# Altium schematic sheet Buck_Converter.SchDoc
size A3; DocumentNumber: 10; SheetNumber: 10; SheetTotal: 11
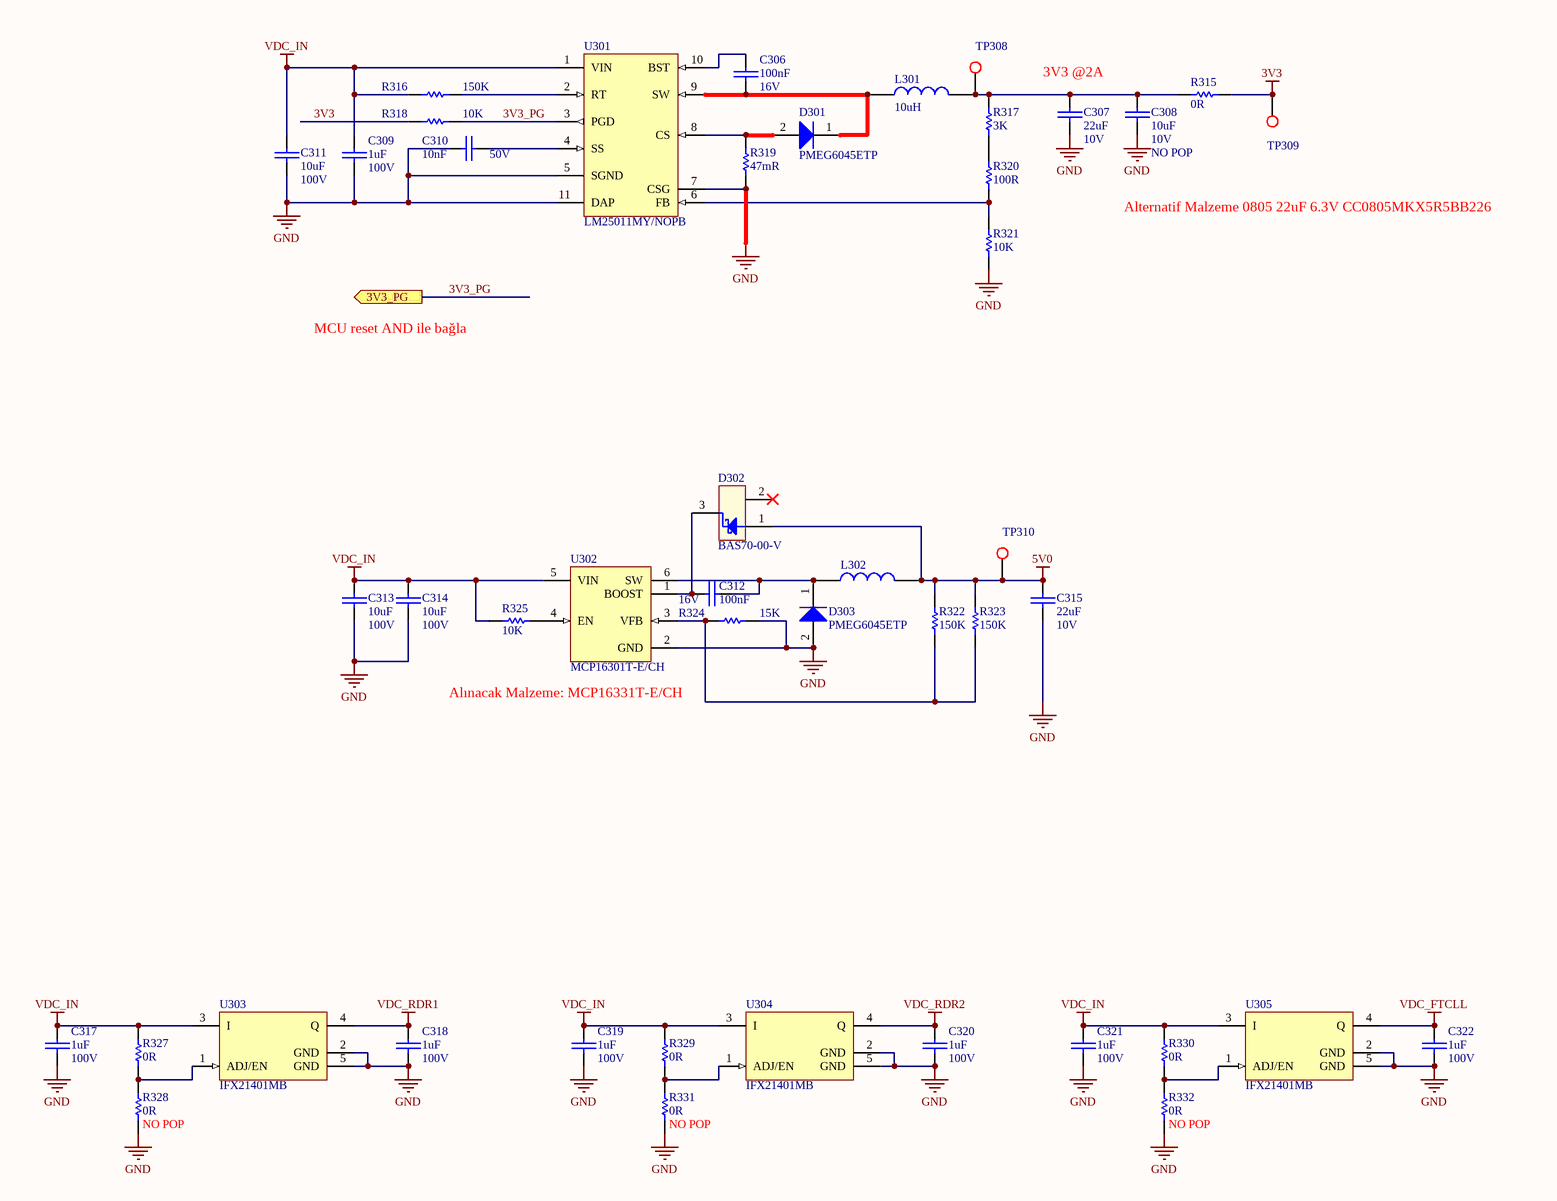
[diagram p0: Buck_Converter.SchDoc]

## Parts
C306  Operating Voltage: 16V  [CAPC1005X06N]  (hidden comment: 100nF)
C307  Operating Voltage: 10V  [CAPC3225X27N]  (hidden comment: 22uF)
C308  Operating Voltage: 10V  Assembly: NO POP  [CAPC2012X09N]  (hidden comment: 10uF)
C309  Operating Voltage: 100V  [CAPC3216X09N]  (hidden comment: 1uF)
C310  Operating Voltage: 50V  [CAPC1005X06N]  (hidden comment: 10nF)
C311  Operating Voltage: 100V  [CAPC5750X25N]  (hidden comment: 10uF)
C312  Operating Voltage: 16V  [CAPC1005X06N]  (hidden comment: 100nF)
C313  Operating Voltage: 100V  [CAPC5750X25N]  (hidden comment: 10uF)
C314  Operating Voltage: 100V  [CAPC5750X25N]  (hidden comment: 10uF)
C315  Operating Voltage: 10V  [CAPC3225X27N]  (hidden comment: 22uF)
C317  Operating Voltage: 100V  [CAPC3216X09N]  (hidden comment: 1uF)
C318  Operating Voltage: 100V  [CAPC3216X09N]  (hidden comment: 1uF)
C319  Operating Voltage: 100V  [CAPC3216X09N]  (hidden comment: 1uF)
C320  Operating Voltage: 100V  [CAPC3216X09N]  (hidden comment: 1uF)
C321  Operating Voltage: 100V  [CAPC3216X09N]  (hidden comment: 1uF)
C322  Operating Voltage: 100V  [CAPC3216X09N]  (hidden comment: 1uF)
D301  PMEG6045ETP  [DIOM3825X11N]
D302  BAS70-00-V  [SOT90P247X115-3N]
D303  PMEG6045ETP  [DIOM3825X11N]
L301  10uH  [INDM125125X65N]
L302  (no value)  [INDM125125X65N]
R315  0R  [RESC2012X07N]
R316  150K  [RESC1005X04N]
R317  3K  [RESC1005X04N]
R318  10K  [RESC1005X04N]
R319  47mR  [RESC3216X08N]
R320  100R  [RESC1005X04N]
R321  10K  [RESC1005X04N]
R322  150K  [RESC1005X04N]
R323  150K  [RESC1005X04N]
R324  15K  [RESC1005X04N]
R325  10K  [RESC1005X04N]
R327  0R  [RESC1005X04N]
R328  Assembly: NO POP  [RESC1005X04N]  (hidden comment: 0R)
R329  0R  [RESC1005X04N]
R330  0R  [RESC1005X04N]
R331  Assembly: NO POP  [RESC1005X04N]  (hidden comment: 0R)
R332  Assembly: NO POP  [RESC1005X04N]  (hidden comment: 0R)
TP308  AEMT-C00S-1000-0000  [TP100]  (value not drawn)
TP309  AEMT-C00S-1000-0000  [TP100]  (value not drawn)
TP310  AEMT-C00S-1000-0000  [TP100]  (value not drawn)
U301  LM25011MY/NOPB  [MUC10A_N]
U302  MCP16301T-E/CH  [MCHP-SOT-23-CH6_N]
U303  IFX21401MB  [INF-PG-SCT595_V]
U304  IFX21401MB  [INF-PG-SCT595_V]
U305  IFX21401MB  [INF-PG-SCT595_V]

## Ports
3V3_PG (out)

## Nets
3V3: R315.2 R318.2 TP309.1
5V0: C315.2 D302.1 L302.2 R322.2 R323.2 TP310.1
GND: C307.1 C308.1 C309.1 C310.1 C311.1 C313.1 C314.1 C315.1 C317.1 C318.1 C319.1 C320.1 C321.1 C322.1 D303.2(A) R319.2 R321.1 R324.1 R328.1 R331.1 R332.1 U301.5(SGND) U301.7(CSG) U301.11(DAP) U302.2(GND) U303.2(GND) U303.5(GND) U304.2(GND) U304.5(GND) U305.2(GND) U305.5(GND)
VDC_FTCLL: C322.2 U305.4(Q)
VDC_IN: C309.2 C311.2 C313.2 C314.2 C317.2 C319.2 C321.2 R316.2 R325.1 R327.2 R329.2 R330.2 U301.1(VIN) U302.5(VIN) U303.3(I) U304.3(I) U305.3(I)
VDC_RDR1: C318.2 U303.4(Q)
VDC_RDR2: C320.2 U304.4(Q)
3V3_PG: R318.1 U301.3(PGD) ; port 3V3_PG
NetC306_1: C306.1 D301.1(K) L301.1 U301.9(SW)
NetC306_2: C306.2 U301.10(BST)
NetC307_2: C307.2 C308.2 L301.2 R315.1 R317.2 TP308.1
NetC310_2: C310.2 U301.4(SS)
NetC312_1: C312.1 D303.1(K) L302.1 U302.6(SW)
NetC312_2: C312.2 D302.3 U302.1(BOOST)
NetD301_2: D301.2(A) R319.1 U301.8(CS)
NetR316_1: R316.1 U301.2(RT)
NetR317_1: R317.1 R320.1
NetR320_2: R320.2 R321.2 U301.6(FB)
NetR322_1: R322.1 R323.1 R324.2 U302.3(VFB)
NetR325_2: R325.2 U302.4(EN)
NetR327_1: R327.1 R328.2 U303.1(ADJ/EN)
NetR329_1: R329.1 R331.2 U304.1(ADJ/EN)
NetR330_1: R330.1 R332.2 U305.1(ADJ/EN)

Not connected (* = marked no-connect by the designer): D302 2(NC)*

## Notes on the sheet
- (near C307) 3V3 @2A
- Alternatif Malzeme 0805 22uF 6.3V CC0805MKX5R5BB226
- MCU reset AND ile bağla
- (near U302) Alınacak Malzeme: MCP16331T-E/CH
- Title
- Size:
- Date:
- A3
- Number:
- Time:
- Revision:
- Sheet
- of
- File:

## Library data of the parts
C306 C312 = ACC7-2100-S241-0000: CAP, CER, X7R, 100nF, %10, 16V, 0402; Manufacturer: Murata; Manufacturer Part Number: GRM155R71C104KA88D; CR: 000049; Requested by: MU; Lead Finish: Pb Free; Material: Ceramic, X7R; Definition Date: 14.08.2012; Revision Date: *; Price: *; Supplier: *; Supplier Part Number: *; DS: 000049; Operating Temp: -55 to 125 C; Storage Temp: -55 to 125 C; Status: Active; Package Reference: EIA 0402, Metric 1005; Component Type: Capacitor; Footprint Type: SMD; Published by: MU; ESR: *; FR: *; Value: 100nF
C307 C315 = ACC7-4220-S730-0000: CAP, CER, X7R, 22uF, %20, 10V, 1210; Manufacturer: Murata; Manufacturer Part Number: GRM32ER71A226KE20L; CR: 000131; Requested by: OO; Lead Finish: Pb Free; Published by: MU; Material: Ceramic, X7R; Definition Date: 31.10.2012; Revision Date: 09.07.2013; Price: *; Supplier: *; Supplier Part Number: *; DS: 000131; Operating Temp: -55 to 125 C; Storage Temp: -55 to 125 C; Status: Active; Package Reference: EIA 1210, Metric 3225; Component Type: Capacitor; Footprint Type: SMD; JEDEC Code: *; ESR: *; FR: *; Value: 22uF
C308 = ACC7-4100-S431-0000: CAP, CER, X7R, 10uF, %10, 10V, 0805; Manufacturer: Murata; Manufacturer Part Number: GRM21BR71A106KE51L; CR: 000049; Requested by: MAY; Lead Finish: Pb Free; Published by: MU; Material: Ceramic, X7R; Definition Date: 22.10.2012; Revision Date: *; Price: *; Supplier: *; Supplier Part Number: *; DS: 000049; Operating Temp: -55 to 125 C; Storage Temp: -55 to 125 C; Status: Active; Package Reference: EIA 0805, Metric 2012; Component Type: Capacitor; Footprint Type: SMD; ESR: *; FR: *; Value: 10uF
C309 C317-C322 = ACC7-3100-S691-0000: CAP, CER, X7R, 1uF, %10, 100V, 1206; Manufacturer: Murata; Manufacturer Part Number: GRM31CR72A105KA01L; CR: 344; Requested by: NK; DS: 00049; Lead Finish: Pb Free; Published by: IS; Material: Ceramic, X7R; Definition Date: 13.02.2014; Revision Date: *; Price: *; Supplier: *; Supplier Part Number: *; Operating Temp: -55 to 125 C; Storage Temp: -55 to 125 C; Status: Active; Package Reference: EIA 1206, Metric 3216; Component Type: Capacitor; Footprint Type: SMD; ESR: *; FR: *; Value: 1uF
C310 = ACC7-1100-S271-0000: CAP, CER, X7R, 10nF, %10, 50V, 0402; Manufacturer: Murata; Manufacturer Part Number: GRM155R71H103KA88D; CR: 000049; Requested by: MU; Lead Finish: Pb Free; Material: Ceramic, X7R; Definition Date: 14.08.2012; Revision Date: *; Price: *; Supplier: *; Supplier Part Number: *; DS: 000049; Operating Temp: -55 to 125 C; Storage Temp: -55 to 125 C; Status: Active; Package Reference: EIA 0402, Metric 1005; Component Type: Capacitor; Footprint Type: SMD; Published by: MU; ESR: *; FR: *; Value: 10nF
C311 C313 C314 = ACC4-4100-SD91-0000: CAP, CER, X7S, 10uF, %10, 100V, 2220; Manufacturer: TDK; Manufacturer Part Number: CGA9N3X7S2A106K230KB; CR: 232; Requested by: MU; DS: 000310; Lead Finish: Pb Free; Material: Ceramic, X7S; Definition Date: 23.08.2013; Revision Date: *; Price: *; Supplier: *; Supplier Part Number: *; Operating Temp: -55 to 125 C; Storage Temp: -55 to 125 C; Status: Active; Package Reference: EIA 5750, Metric 2220; Component Type: Capacitor; Footprint Type: SMD; Published by: MU; FR: *; Value: 10uF
D301 D303 = AS15-945M-SI10-0000: Diode, Schottky, 0.53V @4.5A, 60V, SOD-128; Manufacturer: NXP; Lead Finish: Pb Free; Published by: NK; Price: *; Manufacturer Part Number: PMEG6045ETP; CR: -; DS: -; Definition Date: 25.07.2015; Footprint Type: SMD; JEDEC Code: *; Operating Temp: -55 to 175 C; Package Reference: SOD128; Requested by: NK; Revision Date: *; Status: Active; Storage Temp: -65to 175 C; Supplier: *; Supplier Part Number: *; Component Type: DIODE; Forward Voltage: *; Reverse Voltage: *; Value: *
D302 = AS15-820M-SI20-0002: Diode, Schottky, 0.41V @1mA, BAS70-00-V, SOT23; Manufacturer: VISHAY; CR: 000193/78; DS: 000193; Lead Finish: Pb Free; Published by: MU; Requested by: OO; Reverse Voltage: 70V; Price: *; Manufacturer Part Number: BAS70-00-V; Definition Date: 07.02.2013; Footprint Type: SMD; JEDEC Code: *; Operating Temp: -65 to 125 C; Package Reference: SOT23; Revision Date: 16.02.2013; Status: Active; Storage Temp: -65 to 150 C; Supplier: *; Supplier Part Number: *; Component Type: DIODE; Forward Voltage: 0.41V @1mA; Value: BAS70-00-V
L301 = AL17-1000-SN35-3550: Inductor, Power, 10uH, 5.5A, 20mohm, SMD; Manufacturer: Bourns; Manufacturer Part Number: SRR1260-100M; Published By: NK; Component Type: Power Inductor; Definition Date: 25.07.2015; Footprint Type: SMD; Operating Temp: -40, +125; Rated Current: 5.5A; Requested By: NK; Value: 10uH
L302 = AL17-2200-SN35-3400: Inductor, Power, 22uH, 4A, 43 mohm, SMD; Manufacturer: Bourns; Manufacturer Part Number: SRR1260-220M; Published By: NK; Component Type: Power Inductor; Definition Date: 25.07.2015; Footprint Type: SMD; Operating Temp: -40, +125; Rated Current: 4A; Requested By: NK
R315 = AR19-0000-S407-0000: RES, Thick Film, SMD, 0R, Jumper, 0.125W, 0805; Manufacturer: Panasonic; Manufacturer Part Number: ERJ-6GEY0R00V; CR: 000062; Requested by: MAY; Lead Finish: Pb Free; Published by: MU; Max. Operating Voltage: 150V; Definition Date: 09.11.2012; Revision Date: *; Price: *; Supplier: *; Supplier Part Number: *; DS: 000062; Operating Temp: -55 to 155 C; Storage Temp: -55 to 155 C; Status: Active; Package Reference: EIA 0805, Metric 2012; Component Type: Resistor; Footprint Type: SMD; JEDEC Code: *; Material: Thick Film; ESR: *; FR: *; Power Rating: 0.125W; Value: 0R
R316 R322 R323 = AR19-5150-S2B2-0000: RES, E24, Thick Film, SMD, 150K, 1%, 0.1W, 0402; Manufacturer: Panasonic; Manufacturer Part Number: ERJ-2RKF1503X; CR: DS00073; Requested by: MU; Lead Finish: Pb Free; Max. Operating Voltage: 50V; Definition Date: 16.08.2012; Revision Date: *; Price: *; Supplier: *; Supplier Part Number: *; DS: DS00073; Operating Temp: -55 to 155 C; Storage Temp: -55 to 155 C; Status: Active; Package Reference: EIA 0402, Metric 1005; Component Type: Resistor; Footprint Type: SMD; Published by: MU; JEDEC Code: *; Material: Thick Film; ESR: *; FR: *; Power Rating: 0.1W; Value: 150K
R317 = AR19-3300-S2B2-0000: RES, E24, Thick Film, SMD, 3K, 1%, 0.1W, 0402; Manufacturer: Panasonic; Manufacturer Part Number: ERJ-2RKF3001X; CR: DS00073; Requested by: MU; Lead Finish: Pb Free; Max. Operating Voltage: 50V; Definition Date: 16.08.2012; Revision Date: *; Price: *; Supplier: *; Supplier Part Number: *; DS: DS00073; Operating Temp: -55 to 155 C; Storage Temp: -55 to 155 C; Status: Active; Package Reference: EIA 0402, Metric 1005; Component Type: Resistor; Footprint Type: SMD; Published by: MU; JEDEC Code: *; Material: Thick Film; ESR: *; FR: *; Power Rating: 0.1W; Value: 3K
R318 R321 R325 = AR19-4100-S2B2-0000: RES, E24, Thick Film, SMD, 10K, 1%, 0.1W, 0402; Manufacturer: Panasonic; Manufacturer Part Number: ERJ-2RKF1002X; CR: DS00073; Requested by: MU; Lead Finish: Pb Free; Max. Operating Voltage: 50V; Definition Date: 16.08.2012; Revision Date: *; Price: *; Supplier: *; Supplier Part Number: *; DS: DS00073; Operating Temp: -55 to 155 C; Storage Temp: -55 to 155 C; Status: Active; Package Reference: EIA 0402, Metric 1005; Component Type: Resistor; Footprint Type: SMD; Published by: MU; JEDEC Code: *; Material: Thick Film; ESR: *; FR: *; Power Rating: 0.1W; Value: 10K
R319 = AR19-Y470-S5D2-0000: RES, Thick Film, SMD, 47mR, 1%, 1W, 1206; Manufacturer: Panasonic; Manufacturer Part Number: ERJ-8BWFR047V; CR: 000078/95; Requested by: MU; DS: 000078; Lead Finish: Pb Free; Max. Operating Voltage: 0.40; Definition Date: 19.02.2013; Revision Date: *; Price: *; Supplier: *; Supplier Part Number: *; Operating Temp: -55 to 155 C; Storage Temp: -55 to 155 C; Status: Active; Package Reference: EIA 1206, Metric 3216; Component Type: Resistor; Footprint Type: SMD; Published by: MU; JEDEC Code: *; Material: Thick Film; ESR: *; FR: *; Power Rating: 1W; Value: 47mR
R320 = AR19-2100-S2B2-0000: RES, E24, Thick Film, SMD, 100R, 1%, 0.1W, 0402; Manufacturer: Panasonic; Manufacturer Part Number: ERJ-2RKF1000X; CR: DS00073; Requested by: MU; Lead Finish: Pb Free; Max. Operating Voltage: 50V; Definition Date: 16.08.2012; Revision Date: *; Price: *; Supplier: *; Supplier Part Number: *; DS: DS00073; Operating Temp: -55 to 155 C; Storage Temp: -55 to 155 C; Status: Active; Package Reference: EIA 0402, Metric 1005; Component Type: Resistor; Footprint Type: SMD; Published by: MU; JEDEC Code: *; Material: Thick Film; ESR: *; FR: *; Power Rating: 0.1W; Value: 100R
R324 = AR19-4150-S2B2-0000: RES, E24, Thick Film, SMD, 15K, 1%, 0.1W, 0402; Manufacturer: Panasonic; Manufacturer Part Number: ERJ-2RKF1502X; CR: DS00073; Requested by: MU; Lead Finish: Pb Free; Max. Operating Voltage: 50V; Definition Date: 16.08.2012; Revision Date: *; Price: *; Supplier: *; Supplier Part Number: *; DS: DS00073; Operating Temp: -55 to 155 C; Storage Temp: -55 to 155 C; Status: Active; Package Reference: EIA 0402, Metric 1005; Component Type: Resistor; Footprint Type: SMD; Published by: MU; JEDEC Code: *; Material: Thick Film; ESR: *; FR: *; Power Rating: 0.1W; Value: 15K
R327-R332 = AR19-0000-S201-0000: RES, Thick Film, SMD, 0R, Jumper, 0.1W, 0402; Manufacturer: Panasonic; Manufacturer Part Number: ERJ-2GE0R00X; CR: 000062; Requested by: MAY; Lead Finish: Pb Free; Published by: MU; Max. Operating Voltage: 50V; Definition Date: 09.07.2012; Revision Date: *; Price: *; Supplier: *; Supplier Part Number: *; DS: 000062; Operating Temp: -55 to 155 C; Storage Temp: -55 to 155 C; Status: Active; Package Reference: EIA 0402, Metric 1005; Component Type: Resistor; Footprint Type: SMD; JEDEC Code: *; Material: Thick Film; ESR: *; FR: *; Power Rating: 0.1W; Value: 0R
TP308-TP310 = AEMT-C00S-1000-0000: Test Point, Circular, 1mm; Text: TEST_POINT
U301 = LM25011MY/NOPB: 42V, 2A Constant On-Time Switching Regulator with Adjustable Current Limit, 10-pin eMSOP, Pb-Free; Manufacturer: National Semiconductor; PackageTopMarking: ZXTT*SVUB; PowerWise: N; CompType: Switcher; High-Reliability: Y; DatasheetVersion: Jan-2011; PackageVersion: revA, May-2006; PackageReference: MUC10A; PackageDescription: Molded Mini-SO, Exposed Pad .118 x .118 x .034in Body, 10 Lead, .0197in Pitch; PartNumber: LM25011MY/NOPB; RoHS: Y; PinCount: 10; Code_JEDEC: MO-187-BAT; ComponentLink1Description: Manufacturer URL; ComponentLink1URL: http://www.national.com/; ComponentLink2Description: LM25011 Datasheet; ComponentLink2URL: http://www.national.com/ds/LM/LM25011.pdf; ComponentLink3Description: LM25011 Web Page; ComponentLink3URL: http://www.national.com/pf/LM/LM25011.html; ComponentLink4Description: MUC10A Package Page; ComponentLink4URL: http://www.national.com/packaging/folders/muc10a.html
U302 = MCP16301T-E/CH: High-Voltage Input Integrated Switch Step-Down Regulator, 600 mA, Input Voltage 4.0 to 30 V, Output Voltage 2.0 to 15 V, -40 to 125 degC, 6-pin SOT-23 (CH6), Tape and Reel; Manufacturer: Microchip; DatasheetVersion: Rev. B; PackageVersion: C04-028B; PackageReference: SOT-23-CH6; PackageDescription: 6-Lead Plastic Small Outline Transistor, 2.9 x 1.55 mm Body, 0.95 mm Pitch; Supplier 1: Digi-Key; Supplier Part Number 1: MCP16301T-E/CH-ND; Supplier 2: Newark; Supplier Part Number 2: 31W8729; Supplier 3: Mouser; Supplier Part Number 3: 579-MCP16301T-E/CH; Mounting Technology: Surface Mount; PartNumber: MCP16301T-E/CH; ComponentLink1Description: Manufacturer URL; ComponentLink1URL: http://www.microchip.com; ComponentLink2Description: Datasheet; ComponentLink2URL: http://ww1.microchip.com/downloads/en/DeviceDoc/25004B.pdf; ComponentLink3Description: Package Specification; ComponentLink3URL: http://www.microchip.com/stellent/groups/techpub_sg/documents/packagingspec/en012702.pdf; ComponentLink4Description: Product URL; ComponentLink4URL: http://www.microchip.com/MCP16301
U303-U305 = IFX21401MB: Low Dropout Voltage Tracking Regulator, 4 to 45 V Operating, 50 mA, -40 to 125 degC, PG-SCT595, Reel, Green; Manufacturer: Infineon; Accuracy: 0.5 %; Automotive Qualified: FALSE; Dropout Voltage: 300 mV; Green: TRUE; Max Number Reflow: 3; Max Peak Reflow Temp: 260 degC; Max. Output Current: 50 mA; Output Voltage: adj.; Regulator Type: Linear->tracker; Typical Quiescent Current: 140 uA; DatasheetVersion: Rev. 1.01; PackageVersion: Apr-08; PackageReference: PG-SCT595; PackageDescription: 5-Pin Semiconductor Transistor Package, 2.9 x 1.6 mm Body, 0.95 mm Pitch; Supplier 1: Mouser; Supplier Part Number 1: 726-IFX21401MB; Supplier 2: Newark; Supplier Part Number 2: 47W3452; Supplier 3: Farnell; Supplier Part Number 3: 2215570; Supplier 4: Digi-Key; Supplier Part Number 4: IFX21401MBINTR-ND; Supplier 5: Digi-Key; Supplier Part Number 5: IFX21401MBINCT-ND; Supplier 6: Digi-Key; Supplier Part Number 6: IFX21401MBINDKR-ND; MSL: 1; Packing: Reel; Reset: FALSE; Status Output: FALSE; Mounting Technology: Surface Mount; PartNumber: IFX21401MB; ComponentLink1Description: Manufacturer URL; ComponentLink1URL: http://www.infineon.com/; ComponentLink2Description: Datasheet; ComponentLink2URL: http://www.infineon.com/dgdl/IFX21401_DS_101.pdf?folderId=db3a30431ff988150120802bce1d257a&fileId=db3a304320d39d590120f61daff769d0; ComponentLink3Description: Package Specification; ComponentLink3URL: http://www.infineon.com/dgdl/SCT595-Package_Overview.pdf?folderId=db3a30431936bc4b01195289a4e23b8a&fileId=db3a30431936bc4b0119529a880d3bb2